# Altium schematic sheet RMII.SchDoc
size 420 x 297 mm; SheetNumber: 6; SheetTotal: 6; ListNumber: 2
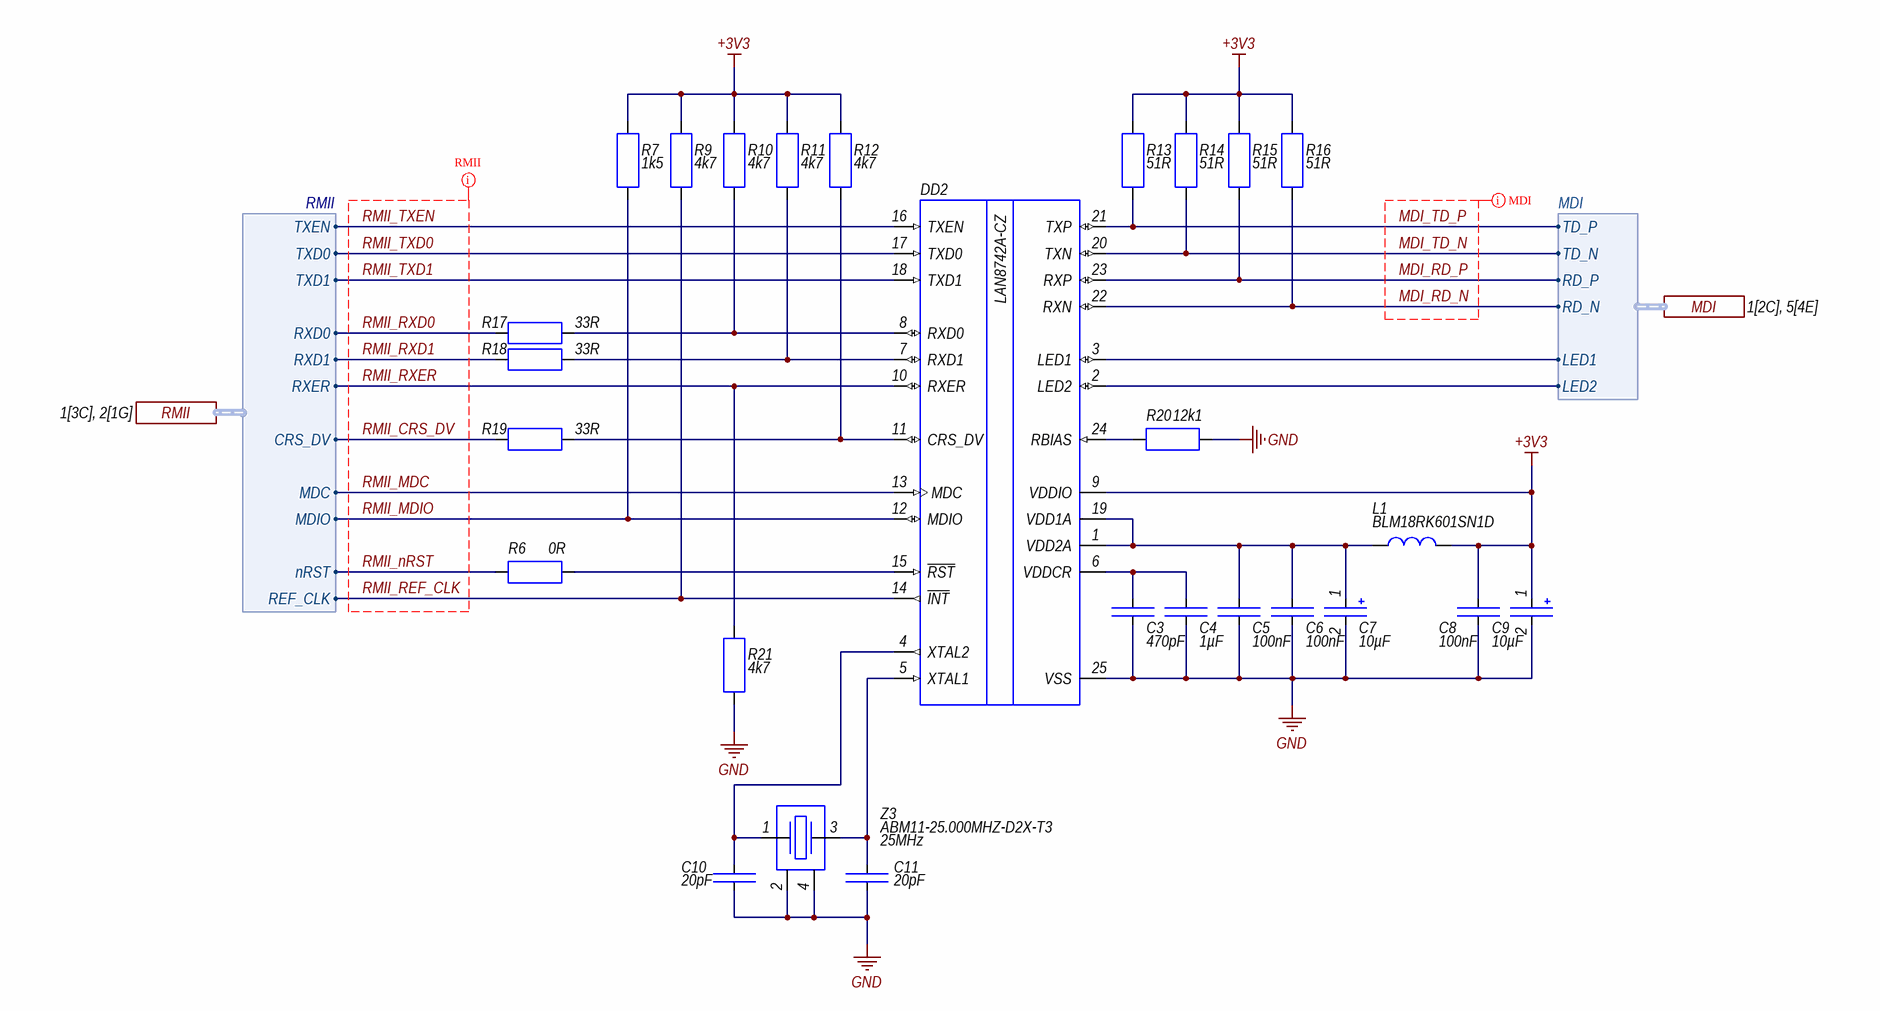
[diagram p0: RMII.SchDoc]

## Parts
C3  Capacitance: 470pF  [Capacitor 0603]  (hidden comment: Конденсатор керам. ЧИП Х7R, 5%, 0603, 470 пФ)
C4  Capacitance: 1µF  [Capacitor 0603]  (hidden comment: Конденсатор керам. ЧИП X5R, 10%, 0603, 1 мкФ)
C5  Device: 100nF  [Capacitor 0603]  (hidden comment: Конденсатор керам. ЧИП X7R, 10%, 0603, 0.1 мкФ)
C6  Device: 100nF  [Capacitor 0603]  (hidden comment: Конденсатор керам. ЧИП X7R, 10%, 0603, 0.1 мкФ)
C7  Device: 10µF  [SMD TANTAL-A]  (hidden comment: Конденсатор тантал. ЧИП 10мкФ х 16 В тип A (AА7))
C8  Device: 100nF  [Capacitor 0603]  (hidden comment: Конденсатор керам. ЧИП X7R, 10%, 0603, 0.1 мкФ)
C9  Device: 10µF  [SMD TANTAL-A]  (hidden comment: Конденсатор тантал. ЧИП 10мкФ х 16 В тип A (AА7))
C10  Capacitance: 20pF  [Capacitor 0603]  (hidden comment: Конденсатор керам. ЧИП NPO, 5%, 0603, 20 пФ)
C11  Capacitance: 20pF  [Capacitor 0603]  (hidden comment: Конденсатор керам. ЧИП NPO, 5%, 0603, 20 пФ)
DD2  Микросхема LAN8742A-CZ  [FP-C04-143B-S4QFN-MFG]  (value not drawn)
L1  Manufacturer Part Number: BLM18RK601SN1D  [BLM18HE152SN1D]  (hidden comment: Дроссель BLM18RK601SN1D)
R6  Device: 0R  [SMD_0402]  (hidden comment: Resistor)
R7  Device: 1k5  [SMD_0402]  (hidden comment: Resistor)
R9  Device: 4k7  [SMD_0402]  (hidden comment: Resistor)
R10  Device: 4k7  [SMD_0402]  (hidden comment: Resistor)
R11  Device: 4k7  [SMD_0402]  (hidden comment: Resistor)
R12  Device: 4k7  [SMD_0402]  (hidden comment: Resistor)
R13  Device: 51R  [SMD_0402]  (hidden comment: Resistor)
R14  Device: 51R  [SMD_0402]  (hidden comment: Resistor)
R15  Device: 51R  [SMD_0402]  (hidden comment: Resistor)
R16  Device: 51R  [SMD_0402]  (hidden comment: Resistor)
R17  Device: 33R  [SMD_0402]  (hidden comment: Resistor)
R18  Device: 33R  [SMD_0402]  (hidden comment: Resistor)
R19  Device: 33R  [SMD_0402]  (hidden comment: Resistor)
R20  Device: 12k1  [SMD_0402]  (hidden comment: Resistor)
R21  Device: 4k7  [SMD_0402]  (hidden comment: Resistor)
Z3  Manufacturer Part Number: ABM11-25.000MHZ-D2X-T3  Device: 25MHz  [ABM11-MFG]  (hidden comment: Резонатор ABM11-25.000MHZ-D2X-T3)

## Ports
MDI (harness MDI, see 1[2C], 5[4E]), RMII (harness RMII, see 1[3C], 2[1G])

## Harnesses
RMII: TXEN, TXD0, RXD0, RXD1, CRS_DV, RXER, MDC, MDIO, nRST, REF_CLK, TXD1
MDI: TD_P, TD_N, RD_P, RD_N, LED1, LED2

## Nets
+3V3: C8.1 C9.1 DD2.9(VDDIO) L1.2 R7.2 R9.2 R10.2 R11.2 R12.2 R13.2 R14.2 R15.2 R16.2
GND: C3.2 C4.2 C5.2 C6.2 C7.2 C8.2 C9.2 C10.2 C11.2 DD2.25(VSS) R20.2 R21.1 Z3.2 Z3.4
MDI_RD_N: DD2.22(RXN) R16.1 ; port MDI.RD_N
MDI_RD_P: DD2.23(RXP) R15.1 ; port MDI.RD_P
MDI_TD_N: DD2.20(TXN) R14.1 ; port MDI.TD_N
MDI_TD_P: DD2.21(TXP) R13.1 ; port MDI.TD_P
RMII_CRS_DV: R19.1 ; port RMII.CRS_DV
RMII_MDC: DD2.13(MDC) ; port RMII.MDC
RMII_MDIO: DD2.12(MDIO) R7.1 ; port RMII.MDIO
RMII_nRST: R6.1 ; port RMII.nRST
RMII_REF_CLK: DD2.14(~{INT}) R9.1 ; port RMII.REF_CLK
RMII_RXD0: R17.1 ; port RMII.RXD0
RMII_RXD1: R18.1 ; port RMII.RXD1
RMII_RXER: DD2.10(RXER) R21.2 ; port RMII.RXER
RMII_TXD0: DD2.17(TXD0) ; port RMII.TXD0
RMII_TXD1: DD2.18(TXD1) ; port RMII.TXD1
RMII_TXEN: DD2.16(TXEN) ; port RMII.TXEN
NetC3_1: C3.1 C4.1 DD2.6(VDDCR)
NetC5_1: C5.1 C6.1 C7.1 DD2.1(VDD2A) DD2.19(VDD1A) L1.1
NetC10_1: C10.1 DD2.4(XTAL2) Z3.1
NetC11_1: C11.1 DD2.5(XTAL1) Z3.3
NetDD2_2: DD2.2(LED2) ; port MDI.LED2
NetDD2_3: DD2.3(LED1) ; port MDI.LED1
NetDD2_7: DD2.7(RXD1) R11.1 R18.2
NetDD2_8: DD2.8(RXD0) R10.1 R17.2
NetDD2_11: DD2.11(CRS_DV) R12.1 R19.2
NetDD2_15: DD2.15(~{RST}) R6.2
NetDD2_24: DD2.24(RBIAS) R20.1

## Layout directives
differential pair; differential pair class MDI: MDI_RD_N, MDI_RD_P, MDI_TD_N, MDI_TD_P
net class RMII: RMII_CRS_DV, RMII_MDC, RMII_MDIO, RMII_nRST, RMII_REF_CLK, RMII_RXD0, RMII_RXD1, RMII_RXER, RMII_TXD0, RMII_TXD1, RMII_TXEN

## Notes on the sheet
- Подп. и дата
- Инв. № дубл.
- Взам. инв. №
- Инв. № подл.
- Изм.
- Лист
- № докум.
- Подп.
- Дата
- Копировал
- Формат А3

## Library data of the parts
C3 = 000171-4: Manufacturer: Kemet Electronics; Manufacturer Part Number: C0603C471J5RACTU; Device: 470pFx50V; Voltage: 50V; PCAD Reader Code: 0; Dielectric: X7R; Info: 470pFx50V; Case: 0603; Pin Count: 2; Storage Code: 0
C4 = 000825-3: Multilayer Ceramic Capacitors MLCC - SMD/SMT 0603 50V 1.0uF X5R 10%; Manufacturer: Murata Electronics; Manufacturer Part Number: GRT188R61H105KE13D; Device: 1µFx50V; PCAD Reader Code: 0; Info: 1µFx50V; Voltage: 50V; Case: 0603; Pin Count: 2; Help URL: https://www.digikey.com/en/products/detail/murata-electronics/GRT188R61H105KE13D/5416752; Storage Code: 0; Tolerance: 10%; Dielectric: X5R
C5 C6 C8 = 000129-4: Manufacturer: Yageo; Manufacturer Part Number: CC0603KPX7R9BB104; Info: 100nFx50V; Voltage: 50V; PCAD Reader Code: 6100; Capacitance: 100nF; Case: 0603; Pin Count: 2; Storage Code: 626; Dielectric: X7R
C7 C9 = 000184-4: Info: 10µFx16V; Voltage: 16V; PCAD Reader Code: 4376; Capacitance: 10µF; Case: Type A; Pin Count: 2; Storage Code: 623; Mounting: SMD
C10 C11 = 000172-5: Manufacturer: Murata Manufacturing; Manufacturer Part Number: GRM1885C1H200J; Device: 20pFx50V; Voltage: 50V; PCAD Reader Code: 10099; Info: 20pFx50V; Case: 0603; Pin Count: 2; Storage Code: 0; Dielectric: NPO
DD2 = 000989-2: Small Footprint RMII 10/100 Ethernet Transceiver with HP Auto-MDIX and flexPWR Technology; Manufacturer: Microchip; PCAD Reader Code: 0; Storage Code: 0; Manufacturer Part Number: LAN8742A-CZ; Info: LAN8742A-CZ; Case: QFN-24; Device: LAN8742A-CZ; Pin Count: 25
L1 = 000967-1: Ferrite Beads Multi-Layer 600Ohm 25% 100MHz 200mA 600mOhm DCR 0603 T/R; Manufacturer: Murata Electronics; PCAD Reader Code: 7563; DC Resistance: 0.6; Storage Code: 0; Help URL: https://www.murata.com/en-us/products/productdetail?partno=BLM18RK601SN1%23; Info: BLM18RK601SN1D; Case: 0603; Device: BLM18RK601SN1D; Pin Count: 2; Rated Current: 200mA
R6 R7 R9-R21 = Resistor_0402: Pin Count: 2; Part Number: Resistor_0402
  R6: Info: 0R; Resistance: 0R
  R7: Info: 1k5; Resistance: 1k5
  R9-R12 R21: Info: 4k7; Resistance: 4k7
  R13-R16: Info: 51R; Resistance: 51R
  R17-R19: Info: 33R; Resistance: 33R
  R20: Info: 12k1; Resistance: 12k1
Z3 = 000855-2: Crystal 25MHz ±20ppm (Tol) ±20ppm (Stability) 10pF FUND 100Ohm 4-Pin Ultra Mini-CSMD T/R; Manufacturer: Abracon; PCAD Reader Code: 0; Shunt Capacitance: 7pF; Temperature Tolerance: 50ppm; Storage Code: 0; Help URL: https://www.farnell.com/datasheets/1936770.pdf; Info: ABM11-25.000MHZ-D2X-T3; Frequency: 25MHz; Pin Count: 4; Frequency Tolerance: 20ppm; Load Capacitance: 10pF